# EAGLE design stacja_meteo_v3 (EAGLE 7.7.0)
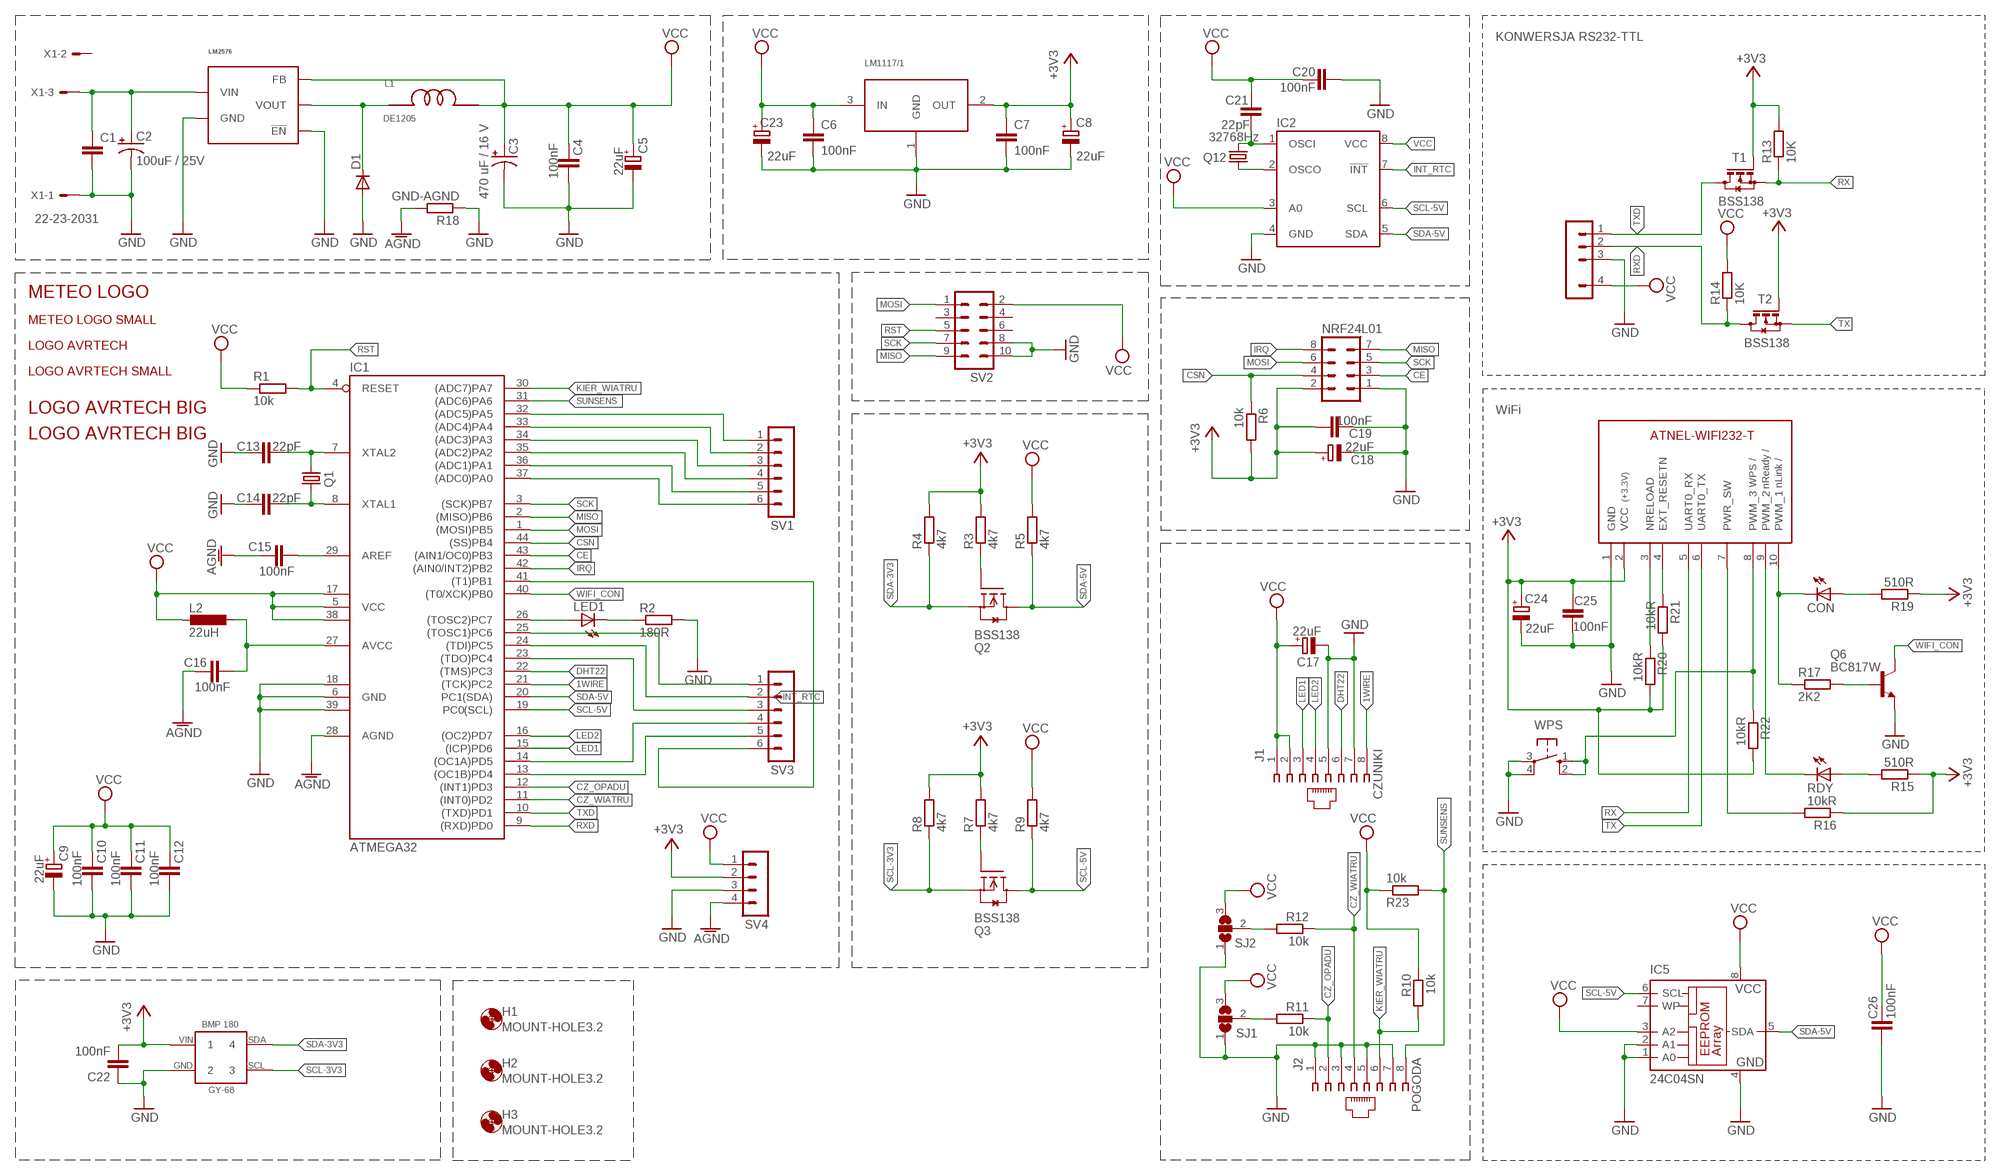
[diagram p0: schematic, sheet 1]

## Parts
BMP1  GY-68  [GY-68]
C1  C-EUC1206  [C1206]
C2  100uF / 25V  CAP_POLD  [PANASONIC_D]
C3  470 uF / 16 V  CAP_POLE  [PANASONIC_E]
C4  100nF  C-EUC1206  [C1206]
C5  22uF  CPOL-EUSMCA  [SMC_A]
C6  100nF  C-EUC0805  [C0805]
C7  100nF  C-EUC0805  [C0805]
C8  22uF  CPOL-EUSMCA  [SMC_A]
C9  22uF  CPOL-EUSMCA  [SMC_A]
C10  100nF  C-EUC1206  [C1206]
C11  100nF  C-EUC1206  [C1206]
C12  100nF  C-EUC1206  [C1206]
C13  22pF  C-EUC0805K  [C0805K]
C14  22pF  C-EUC0805K  [C0805K]
C15  100nF  C-EUC1206  [C1206]
C16  100nF  C-EUC1206  [C1206]
C17  22uF  CPOL-EUSMCA  [SMC_A]
C18  22uF  CPOL-EUSMCA  [SMC_A]
C19  100nF  C-EUC0805  [C0805]
C20  100nF  C-EUC1206K  [C1206K]
C21  22pF  C-EUC1206K  [C1206K]
C22  100nF  C-EUC1206  [C1206]
C23  22uF  CPOL-EUSMCA  [SMC_A]
C24  22uF  CPOL-EUSMCA  [SMC_A]
C25  100nF  C-EUC0805  [C0805]
C26  100nF  C-EUC1206K  [C1206K]
CON  LEDSML0805  [SML0805]
D1  DIODE-SMC  [SMC]
H1  MOUNT-HOLE3.2  [3,2]
H2  MOUNT-HOLE3.2  [3,2]
H3  MOUNT-HOLE3.2  [3,2]
IC1  ATMEGA32  MEGA32ORIGINAL  [TQFP44]
IC2  RTC_PCF8583T  [SO08]
IC5  24C04SN  [SO-08]
J1  CZUNIKI  556416-1  [556416-1]
J2  POGODA  556416-1  [556416-1]
L1  DE1205  [DE1205]
L2  22uH  L-EUIR-2  [IR-2]
LED1  LED5MM  [LED5MM]
LM1117/1  LM1117-3.3  [SOT223]
LM2576  LM2576D2PAK-5  [D2PAK-5]
NRF24L01  ML10  [ML10]
Q1  11.059 MHz  CSM-7X-DU  [CSM-7X-DU]
Q2  BSS138  [SOT23]
Q3  BSS138  [SOT23]
Q6  BC817W  BC817-16LT1SMD  [SOT23-BEC]
Q12  32768Hz  MC-406  [MC-406]
R1  10k  R-EU_R0603  [R0603]
R2  180R  R-EU_R0805  [R0805]
R3  4k7  R-EU_R0805  [R0805]
R4  4k7  R-EU_R0805  [R0805]
R5  4k7  R-EU_R0805  [R0805]
R6  10k  R-EU_R0805W  [R0805W]
R7  4k7  R-EU_R0805  [R0805]
R8  4k7  R-EU_R0805  [R0805]
R9  4k7  R-EU_R0805  [R0805]
R10  10k  R-EU_R0603  [R0603]
R11  10k  R-EU_R0603  [R0603]
R12  10k  R-EU_R0603  [R0603]
R13  10K  R-EU_R0805  [R0805]
R14  10K  R-EU_R0805  [R0805]
R15  510R  R-EU_R0603  [R0603]
R16  10kR  R-EU_R0603  [R0603]
R17  2K2  R-EU_R0603  [R0603]
R18  GND-AGND  R-EU_R0805  [R0805]
R19  510R  R-EU_R0603  [R0603]
R20  10kR  R-EU_R0603  [R0603]
R21  10kR  R-EU_R0603  [R0603]
R22  10kR  R-EU_R0603  [R0603]
R23  10k  R-EU_R0603  [R0603]
RDY  LEDSML0805  [SML0805]
RS232-TTL  ATB-BTM-222  [ATB-BTM-222]
SJ1  SJ2W  [SJ_2]
SJ2  SJ2W  [SJ_2]
SV1  MA06-1  [MA06-1]
SV2  ML10  [ML10]
SV3  MA06-1  [MA06-1]
SV4  MA04-1  [MA04-1]
T1  BSS138  BSS123  [SOT23]
T2  BSS138  BSS123  [SOT23]
U$2  ATNEL-WIFI232-T_2  [ATNEL-WIFI232-T_2]
U$3  METEO_LOGO  [LOGO_METEO]
U$4  METEO_LOGO_SMALL  [LOGO_METEO_SMALL]
U$6  LOGO_AVRTECH  [LOGO_AVRTECH]
U$7  LOGO_AVRTECH_SMALL  [LOGO_AVRTECH_SMALL]
U$8  LOGO_AVRTECH_BIG  [LOGOAVRTECHBIG]
U$9  LOGO_AVRTECH_BIG  [LOGOAVRTECHBIG]
WPS  10-XX  [B3F-10XX]
X1  22-23-2031  [22-23-2031]

## Nets
1WIRE: IC1.21((TCK)PC2) J1.8
+3V3: BMP1.1 C7.1 C8.+ C18.+ C19.1 C22.2 C24.+ C25.1 LM1117/1.2(OUT) NRF24L01.2 R3.2 R4.2 R6.2 R7.2 R8.2 R13.2 R15.1 R16.1 R19.1 R20.2 R21.2 R22.2 SV4.2 T1.1(G) T2.1(G) U$2.2(VCC)
AGND: C15.1 C16.1 IC1.28(AGND) R18.2 SV4.4
CE: IC1.43((AIN1/OC0)PB3) NRF24L01.3
CSN: IC1.44((SS)PB4) NRF24L01.4 R6.1
CZ_OPADU: IC1.12((INT1)PD3) J2.2 R11.1
CZ_WIATRU: IC1.11((INT0)PD2) J2.4 R12.1
DHT22: IC1.22((TMS)PC3) J1.6
GND: BMP1.2 C1.2 C2.- C3.- C4.2 C5.- C6.2 C7.2 C8.- C9.- C10.2 C11.2 C12.2 C13.1 C14.1 C17.- C18.- C19.2 C20.2 C22.1 C23.- C24.- C25.2 C26.2 D1.A IC1.6(GND) IC1.18(GND1) IC1.39(GND2) IC2.4(GND) IC5.1(A0) IC5.2(A1) IC5.4(GND) J1.5 J1.7 J2.1 J2.3 J2.5 J2.7 LM1117/1.1(GND) LM2576.P$3(GND) LM2576.P$5(!EN) LM2576.P$6(GND) NRF24L01.1 Q6.E R2.2 R18.1 RS232-TTL.3(GND) SJ1.1 SJ2.1 SV2.8 SV2.10 SV4.3 U$2.1(GND) WPS.3(P) WPS.4(P1) X1.1
INT_RTC: IC1.24((TDI)PC5) IC2.7(!INT) SV3.2
IRQ: IC1.42((AIN0/INT2)PB2) NRF24L01.8
KIER_WIATRU: IC1.30((ADC7)PA7) J2.6 R10.2
LED1: IC1.15((ICP)PD6) J1.3
LED2: IC1.16((OC2)PD7) J1.4
MISO: IC1.2((MISO)PB6) NRF24L01.7 SV2.9
MOSI: IC1.1((MOSI)PB5) NRF24L01.6 SV2.1
N$1: C15.2 IC1.29(AREF)
N$2: IC1.26((TOSC2)PC7) LED1.A
N$3: C16.2 IC1.27(AVCC) L2.1
N$4: LED1.K(C) R2.1
N$6: Q2.1(G) R3.1
N$7: C13.2 IC1.7(XTAL2) Q1.2
N$8: C14.2 IC1.8(XTAL1) Q1.1
N$9: R15.2 RDY.A
N$10: R12.2 SJ2.2
N$11: R11.2 SJ1.2
N$12: RDY.C U$2.9(PWM_2)
N$13: Q3.1(G) R7.1
N$14: R16.2 U$2.7(PWR_SW)
N$15: R20.1 U$2.3(NRELOAD)
N$16: R21.1 U$2.4(EXT_RESETN)
N$17: IC1.32((ADC5)PA5) SV1.1
N$18: Q6.B R17.2
N$19: IC1.33((ADC4)PA4) SV1.2
N$20: R22.1 U$2.8(PWM_3) WPS.1(S) WPS.2(S1)
N$21: IC1.34((ADC3)PA3) SV1.3
N$22: IC1.35((ADC2)PA2) SV1.4
N$23: IC1.36((ADC1)PA1) SV1.5
N$24: CON.A R19.2
N$25: IC1.37((ADC0)PA0) SV1.6
N$26: IC1.41((T1)PB1) SV3.6
N$27: IC1.25((TOSC1)PC6) SV3.1
N$29: IC1.23((TDO)PC4) SV3.3
N$30: IC1.14((OC1A)PD5) SV3.4
N$31: IC1.13((OC1B)PD4) SV3.5
N$36: D1.C L1.P$1 LM2576.P$2(VOUT)
N$37: C1.1 C2.+ LM2576.P$1(VIN) X1.3
N$54: IC2.2(OSCO) Q12.2
OSCI1: C21.2 IC2.1(OSCI) Q12.1
PWM_1: CON.C R17.1 U$2.10(PWM_1)
RST: IC1.4(RESET) R1.2 SV2.5
RX: R13.1 T1.2(S) U$2.5(UART0_RX)
RXD: IC1.9((RXD)PD0) R14.1 RS232-TTL.2(TX) T2.3(D)
SCK: IC1.3((SCK)PB7) NRF24L01.5 SV2.7
SCL-3V3: BMP1.3 Q3.2(S) R8.1
SCL-5V: IC1.19(PC0(SCL)) IC2.6(SCL) IC5.6(SCL) Q3.3(D) R9.1
SDA-3V3: BMP1.4 Q2.2(S) R4.1
SDA-5V: IC1.20(PC1(SDA)) IC2.5(SDA) IC5.5(SDA) Q2.3(D) R5.1
SUNSENS: IC1.31((ADC6)PA6) J2.8 R23.2
TX: T2.2(S) U$2.6(UART0_TX)
TXD: IC1.10((TXD)PD1) RS232-TTL.1(RX) T1.3(D)
VCC: C3.+ C4.1 C5.+ C6.1 C9.+ C10.1 C11.1 C12.1 C17.+ C20.1 C21.1 C23.+ C26.1 IC1.5(VCC) IC1.17(VCC1) IC1.38(VCC2) IC2.3(A0) IC2.8(VCC) IC5.3(A2) IC5.8(VCC) J1.1 J1.2 L1.P$3 L2.2 LM1117/1.3(IN) LM2576.P$4(FB) R1.1 R5.2 R9.2 R10.1 R14.2 R23.1 RS232-TTL.4(VCC) SJ1.3 SJ2.3 SV2.2 SV4.1
WIFI_CON: IC1.40((T0/XCK)PB0) Q6.C
Unconnected: IC5.7(WP) SV2.3 SV2.4 SV2.6 X1.2

## Notes on the sheet
- KONWERSJA RS232-TTL
- WiFi

## Library data of the parts
BMP1 = 0_majes_0:GY-68
C1 C4 C6 C7 C10-C16 C19-C22 C25 C26 = rcl:C-EU: CAPACITOR, European symbol
C2 C3 = SparkFun-Capacitors:CAP_POL: Capacitor Polarized These are standard SMD and PTH capacitors. Normally 10uF, 47uF, and 100uF in electrolytic and tantalum varieties. Always verify the external diameter of the through hole cap, it varies with capacity, voltage, and manufacturer. The EIA devices should be standard.
C5 C8 C9 C17 C18 C23 C24 = rcl:CPOL-EU: POLARIZED CAPACITOR, European symbol
CON RDY = led:LED: LED
D1 = diode:DIODE-: DIODE
H1-H3 = holes:MOUNT-HOLE: MOUNTING HOLE with drill center marker
IC1 = 0_majes_0:MEGA32: MICROCONTROLLER 32 Kbytes FLASH 2 Kbytes SRAM 1 Kbytes EEPROM USART 8-channel 10 bit ADC Size Small 59 x 17 mills pad size Medium 59 x 18 mills pad size Medium 59 x 19 mills pad size
IC2 = 0_majes_0:RTC_PCF8583T
IC5 = microchip:24C*: Serial EEPROM 1 K/2 K/4 K; MPN: M24C04-WMN6P; OC_FARNELL: 9882812; OC_NEWARK: 83K1376
J1 J2 = con-amp:556416-1: AMP connector
L1 = EAGLE_LBR_RAF_TECH:DE1205
L2 = rcl:L-EU: INDUCTOR, European symbol
LED1 = adafruit:LED: LED
LM1117/1 = 0_majes_0:LM1117-3.3
LM2576 = EAGLE_LBR_RAF_TECH:LM2576
NRF24L01 = 0_majes_0:ML10: HARTING; OC_FARNELL: unknown; OC_NEWARK: unknown
Q1 = crystal:CSM-7X-DU: SMD CRYSTAL Source: www.ecsxtal.com .. Crystal 3.6864MHz CSM_7X_DU.PDF; OC_FARNELL: unknown; OC_NEWARK: unknown
Q2 Q3 = m-pad-2.1:BSS138: Fairchild Semiconductors BSS138 N-Channel Logic Level Enhancement Mode Field Effect Transistor General Description: These N-Channel enhancement mode field effect transistors are produced using Fairchild's proprietary, high cell density, DMOS technology. These products have been designed to minimize on-state resistance while provide rugged, reliable, and fast switching performance.These products are particularly suited for low voltage, low current applications such as small servo motor control, power MOSFET gate drivers, and other switching applications. Features: 0.22 A, 50 V. RDS(ON) = 3.5Ohm @ VGS = 10 V RDS(ON) = 6.0Ohm @ VGS = 4.5 V High density cell design for extremely low RDS(ON) Rugged and Reliable Compact industry standard SOT-23 surface mount package Please send any comments to: messi@users.sourceforge.net
Q6 = transistor-npn:BC817*: NPN Transistor
Q12 = 0_majes_0:MC-406: kHz RANGE CRYSTAL UNIT SMD Source: MC-306_405_406_E07X.PDF Homepage <http://www.epsontoyocom.co.jp>; MF: BANNER ENGINEERING CORPORATION; MPN: MQDMC-406; OC_FARNELL: 1216226; OC_NEWARK: 21H2317
R1-R12 R15-R23 = rcl:R-EU_: RESISTOR, European symbol
R13 R14 = resistor:R-EU_: RESISTOR, European symbol
RS232-TTL = 0_majes_0:ATB-BTM-222
SJ1 SJ2 = jumper:SJ2W: SMD solder JUMPER
SV1 SV3 = 0_majes_0:MA06-1: PIN HEADER; OC_FARNELL: unknown; OC_NEWARK: unknown
SV2 = con-harting-ml:ML10: HARTING; OC_FARNELL: unknown; OC_NEWARK: unknown
SV4 = 0_majes_0:MA04-1: PIN HEADER; OC_FARNELL: unknown; OC_NEWARK: unknown
T1 T2 = transistor-small-signal:BSS123: N-CHANNEL MOS FET
U$2 = ATNEL-WIFI232-T:ATNEL-WIFI232-T_2
U$3 = 0_majes_0:METEO_LOGO
U$4 = 0_majes_0:METEO_LOGO_SMALL
U$6 = 0_majes_0:LOGO_AVRTECH
U$7 = 0_majes_0:LOGO_AVRTECH_SMALL
U$8 U$9 = 0_majes_0:LOGO_AVRTECH_BIG
WPS = switch-omron:10-XX: OMRON SWITCH; MPN: B3F-1000; OC_FARNELL: 176432; OC_NEWARK: 36M3542
X1 = con-molex:22-23-2031: .100" (2.54mm) Center Header - 3 Pin; MF: MOLEX; MPN: 22-23-2031; OC_FARNELL: 1462950; OC_NEWARK: 30C0862

## Board
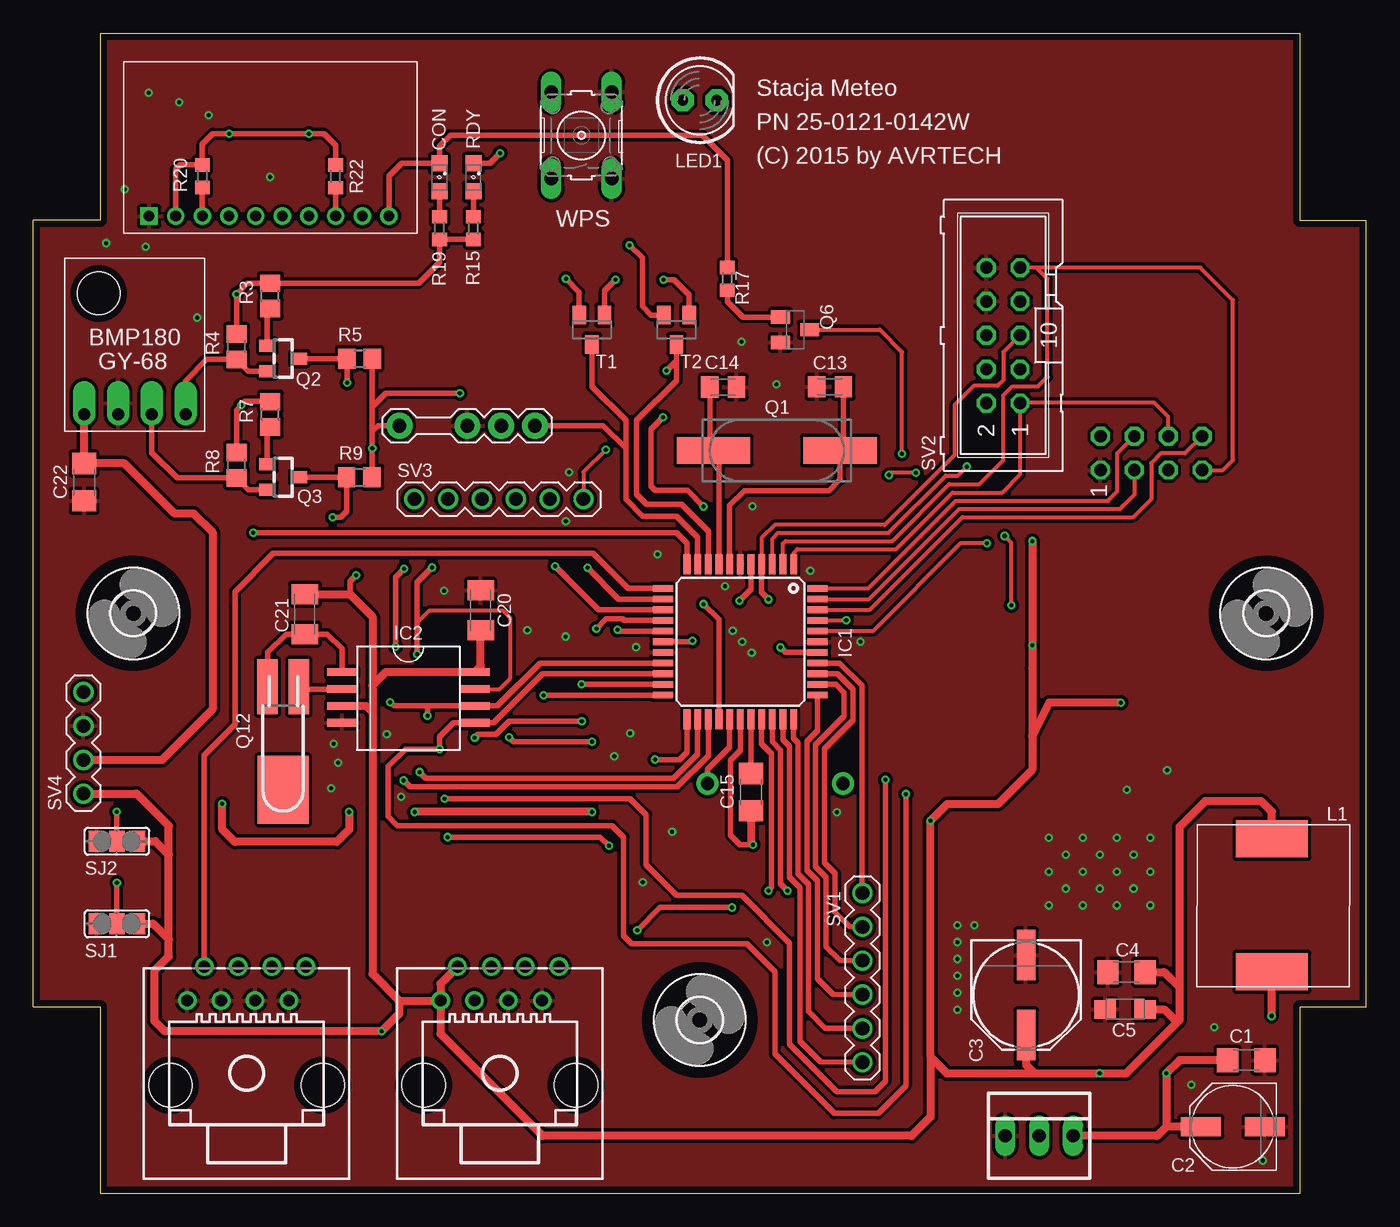
[diagram p1: board, top side]
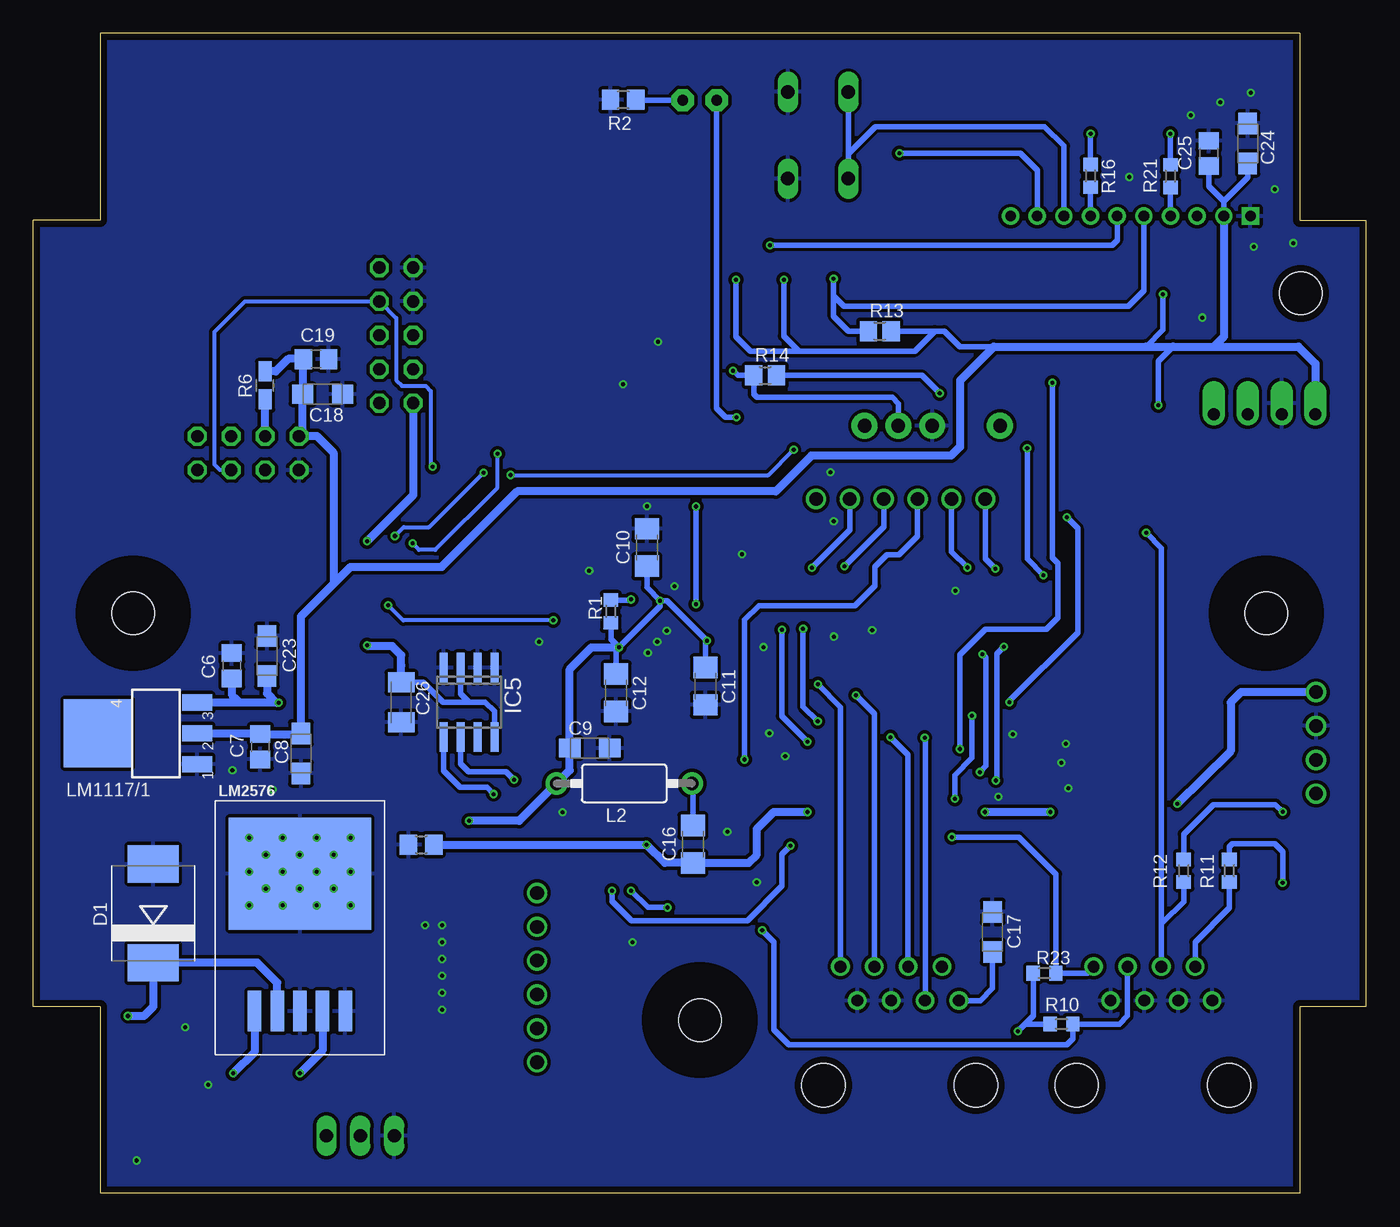
[diagram p2: board, bottom side, seen from below]

Size 100 x 87 mm. Coordinates in mm from the lower left corner, seen from the top.
Outline: 5,87 95,87 95,73 100,73 100,14 95,14 95,0 5,0 5,14 0,14 0,73 5,73 5,87
Copper layers (1*16): Top 0.035mm / dielectric 1.5mm / Bottom 0.035mm
Design rules "EagleRules": minimum track width 7mil, minimum drill 12mil, track to track 7mil, track to pad 7mil, pad to pad 7mil, via to via 7mil, smd to smd 0mil, copper to edge 20mil, drill to drill 10mil, minimum pad ring 10mil, minimum via ring 6mil, stop-mask expansion 2mil, vias tented up to drill 25mil, thermal gap 10mil

### Footprints (pad centres in the part's own frame; a part is rotated, then mirrored left to right if it is on the bottom)
GY-68 = drill 0.9 pad 1.676 offset: 1 -3.81,-3.81; 2 -1.27,-3.81; 3 1.27,-3.81; 4 3.81,-3.81 | hole 3.2: -2.71,5.26
C1206 = smd 1.6 x 1.8: 1 -1.4,0; 2 1.4,0
PANASONIC_D = smd 3 x 1.4: + 2.4,0; - -2.4,0
PANASONIC_E = smd 3.8 x 1.4: + 3,0; - -3,0
SMC_A = smd 1.6 x 1.4: + -1.5,0; - 1.5,0
C0805 = smd 1.3 x 1.5: 1 -0.95,0; 2 0.95,0
C0805K = smd 1.3 x 1.6: 1 -1,0; 2 1,0
C1206K = smd 1.5 x 2: 1 -1.5,0; 2 1.5,0
SML0805 = smd 1.2 x 1.2: A 1.05,0; C -1.05,0
SMC = smd 2.8 x 3.8: A 3.7,0; C -3.7,0
3,2 = hole 3.2: 0,0
TQFP44 = smd 1.5 x 0.5: 1 -5.8,4; 2 -5.8,3.2; 3 -5.8,2.4; 4 -5.8,1.6; 5 -5.8,0.8; 6 -5.8,0; 7 -5.8,-0.8; 8 -5.8,-1.6; 9 -5.8,-2.4; 10 -5.8,-3.2; 11 -5.8,-4; 23 5.8,-4; 24 5.8,-3.2; 25 5.8,-2.4; 26 5.8,-1.6; 27 5.8,-0.8; 28 5.8,0; 29 5.8,0.8; 30 5.8,1.6; 31 5.8,2.4; 32 5.8,3.2; 33 5.8,4 | smd 0.5 x 1.5: 12 -4,-5.8; 13 -3.2,-5.8; 14 -2.4,-5.8; 15 -1.6,-5.8; 16 -0.8,-5.8; 17 0,-5.8; 18 0.8,-5.8; 19 1.6,-5.8; 20 2.4,-5.8; 21 3.2,-5.8; 22 4,-5.8; 34 4,5.8; 35 3.2,5.8; 36 2.4,5.8; 37 1.6,5.8; 38 0.8,5.8; 39 0,5.8; 40 -0.8,5.8; 41 -1.6,5.8; 42 -2.4,5.8; 43 -3.2,5.8; 44 -4,5.8
SO08 = smd 2.235 x 0.584: 1 -4.978,1.905; 2 -4.978,0.635; 3 -4.978,-0.635; 4 -4.978,-1.905; 5 4.978,-1.905; 6 4.978,-0.635; 7 4.978,0.635; 8 4.978,1.905
SO-08 = smd 0.6 x 2.2: 1 -1.905,-2.6; 2 -0.635,-2.6; 3 0.635,-2.6; 4 1.905,-2.6; 5 1.905,2.6; 6 0.635,2.6; 7 -0.635,2.6; 8 -1.905,2.6
556416-1 = drill 0.889: 1 -4.445,5.461; 2 -3.175,8.001; 3 -1.905,5.461; 4 -0.635,8.001; 5 0.635,5.461; 6 1.905,8.001; 7 3.175,5.461; 8 4.445,8.001 | hole 3.251: -5.715,-0.889; 5.715,-0.889
DE1205 = smd 5.4 x 2.8: P$1 0.1,3.91; P$3 0.1,-6.07
IR-2 = drill 1 pad 1.676: 1 -5.08,0; 2 5.08,0
LED5MM = drill 0.813 pad 1.676 octagon: A -1.27,0; K 1.27,0
SOT223 = smd 1.219 x 2.235: 1 -2.311,-3.099; 2 0,-3.099; 3 2.311,-3.099 | smd 5.08 x 5.08: 4 0,4.369
D2PAK-5 = smd 3.05 x 1.016: P$1 4.335,-3.404; P$2 4.335,-1.702; P$3 4.335,0; P$4 4.335,1.702; P$5 4.335,3.404 | smd 8.38 x 10.66: P$6 -5.97,0
ML10 = drill 0.914 octagon: 1 -3.81,-1.27; 2 -3.81,1.27; 3 -1.27,-1.27; 4 -1.27,1.27; 5 1.27,-1.27; 6 1.27,1.27; 7 3.81,-1.27; 8 3.81,1.27
CSM-7X-DU = smd 5.5 x 2: 1 -4.75,0; 2 4.75,0
SOT23 = smd 0.9 x 1.2: 1 -0.95,-1.2; 2 0.95,-1.2; 3 0,1.2
SOT23-BEC = smd 1 x 1.4: B -0.95,-1.1; C 0,1.1; E 0.95,-1.1
MC-406 = smd 4.1 x 1.52: 1 -4,-1.175; 2 -4,1.175 | smd 5.08 x 3.81: 3 3.74,0
R0603 = smd 1 x 1.1: 1 -0.85,0; 2 0.85,0
R0805 = smd 1.3 x 1.5: 1 -0.95,0; 2 0.95,0
R0805W = smd 1.5 x 1: 1 -1.052,0; 2 1.052,0
R0805' = smd 1.3 x 1.5: 1 -0.85,0; 2 0.85,0
ATB-BTM-222 = drill 1.016 pad 1.93: 1 -0.013,5.076; 2 -0.013,2.536; 3 -0.013,-0.004; 4 -0.013,-5.084
SJ_2 = smd 1.168 x 1.6: 1 -1.524,0; 2 0,0; 3 1.524,0
MA06-1 = drill 1.016: 1 -6.35,0; 2 -3.81,0; 3 -1.27,0; 4 1.27,0; 5 3.81,0; 6 6.35,0
ML10' = drill 0.914 octagon: 1 -5.08,-1.27; 2 -5.08,1.27; 3 -2.54,-1.27; 4 -2.54,1.27; 5 0,-1.27; 6 0,1.27; 7 2.54,-1.27; 8 2.54,1.27; 9 5.08,-1.27; 10 5.08,1.27
MA04-1 = drill 1.016: 1 -3.81,0; 2 -1.27,0; 3 1.27,0; 4 3.81,0
SOT23' = smd 1 x 1.4: 1 -0.95,-1.1; 2 0.95,-1.1; 3 0,1.1
ATNEL-WIFI232-T_2 = drill 0.8 pad 1.27 square: 1 -9.1,-5.45 | drill 0.8 pad 1.27: 2 -7.1,-5.45; 3 -5.1,-5.45; 4 -3.1,-5.45; 5 -1.1,-5.45; 6 0.9,-5.45; 7 2.9,-5.45; 8 4.9,-5.45; 9 6.9,-5.45; 10 8.9,-5.45
B3F-10XX = drill 1.016 long: 1 -3.251,2.261; 2 3.251,2.261; 3 -3.251,-2.261; 4 3.251,-2.261
22-23-2031 = drill 1 long: 1 -2.54,0; 2 0,0; 3 2.54,0

### Placement (x,y rotation side)
BMP1  7.62,62.23 0 top
C1  91,10 0 top
C2  90,5 180 top
C3  74.48,14.87 270 top
C4  82.01,16.6 180 top
C5  81.91,13.8 180 top
C6  85.11,39.57 90 bottom
C7  82.97,33.5 270 bottom
C8  79.92,33 270 bottom
C9  58.26,33.39 0 bottom
C10  53.97,48.44 90 bottom
C11  49.57,38.04 270 bottom
C12  56.27,37.54 270 bottom
C13  59.78,60.5 0 top
C14  51.75,60.47 180 top
C15  53.85,30.1 90 top
C16  50.51,26.18 90 bottom
C17  28.03,19.61 90 bottom
C18  78.3,59.93 0 bottom
C19  78.8,62.57 0 bottom
C20  33.56,43.73 90 top
C21  20.37,43.45 270 top
C22  3.81,53.34 90 top
C23  82.47,40.31 90 bottom
C24  8.89,78.74 90 bottom
C25  11.81,77.99 90 bottom
C26  72.39,36.83 270 bottom
CON  30.48,76.2 270 top
D1  91,21 90 bottom
H1  50,13 0 top
H2  7.5,43.5 0 top
H3  92.5,43.5 0 top
IC1  53.04,41.37 270 top
IC2  28.14,37.19 0 top
IC5  67.31,36.83 180 bottom
J1  35,9 0 top
J2  16,9 0 top
L1  93.02,20.53 180 top
L2  55.66,30.74 180 bottom
LED1  50,81.98 0 top
LM1117/1  90.8,34.5 90 bottom
LM2576  80,18 270 bottom
NRF24L01  83.88,55.52 0 top
Q1  55.78,55.71 0 top
Q2  18.75,62.61 270 top
Q3  18.75,53.72 270 top
Q6  57.15,64.77 270 top
Q12  18.74,34 270 top
R1  56.67,43.64 90 bottom
R2  55.74,82.01 180 bottom
R3  17.78,67.31 90 top
R4  15.24,63.5 90 top
R5  24.49,62.61 0 top
R6  82.61,60.6 90 bottom
R7  17.78,58.42 90 top
R8  15.24,54.61 90 top
R9  24.46,53.72 0 top
R10  22.86,12.7 0 bottom
R11  10.27,24.2 90 bottom
R12  13.69,24.2 90 bottom
R13  10K  [R0805']  36.5,64.67 0 bottom
R14  10K  [R0805']  45.1,61.34 0 bottom
R15  33.02,72.39 90 top
R16  20.68,76.3 270 bottom
R17  52.07,68.58 270 top
R18  70.9,26.16 0 bottom
R19  30.48,72.39 90 top
R20  12.68,76.28 90 top
R21  14.69,76.3 90 bottom
R22  22.68,76.27 90 top
R23  24.13,16.51 0 bottom
RDY  33.02,76.2 270 top
RS232-TTL  32.56,57.56 270 top
SJ1  6.27,20.22 0 top
SJ2  6.27,26.41 0 top
SV1  62.2,16.18 90 top
SV2  [ML10']  72.77,64.35 90 top
SV3  34.92,52.07 0 top
SV4  3.76,33.78 90 top
T1  BSS138  [SOT23']  41.91,64.77 180 top
T2  BSS138  [SOT23']  48.26,64.77 180 top
U$2  17.78,78.74 0 top
U$3  87.63,71.12 0 bottom
U$4  55.24,70.48 0 top
U$6  33.3,28.96 0 top
U$7  59.69,67.31 0 top
U$8  66.04,29.21 0 top
U$9  20.32,29.21 0 bottom
WPS  41.12,79.35 90 top
X1  75.46,4.32 0 top

### Tracks (layer width: path | path; a pad name or v marks a point on that pad's centre or on a via)
1WIRE  (via drill 0.3)
  Top 0.406: IC1.21 v41.14,38.17
  Bottom 0.406: J1.8 39.45,36.47 v41.14,38.17
+3V3  (via drill 0.3)
  Top 0.406: R8.2 15.24,58.74 v15.6,59.1 15.9,59.4 17.75,59.4 R7.2 | R4.2 v15.24,67.44 16.06,68.26 R3.2 28.89,68.26 30.48,69.85 R19.1 R15.1 | T1.1 42.86,67.7 v43.69,68.53 | T2.1 49.21,67.4 48.08,68.53 v47.3,68.53 | R22.2 22.68,78.61 21.82,79.48 v20.68,79.48 v14.71,79.48 13.46,79.48 12.68,78.69 R20.2 12.66,77.14 11.02,77.14 10.68,76.8 U$2.2
  Top 0.61: BMP1.1 C22.2 6.83,54.74 10.59,50.98 12.04,50.98 13.49,49.53 13.49,36.35 9.65,32.51 SV4.2
  Bottom 0.406: 79.75,59.98 C18.+ 80.07,59.93 | v15.6,59.1 15.6,62.4 14.5,63.5 | v15.24,67.44 15.24,64.76 16.5,63.5 | R13.2 32.36,64.67 | 32.36,64.67 31.65,64.67 30.48,63.5 27.94,63.5 | v47.3,68.53 47.3,64.26 46.2,63.17 42.57,63.17 | 42.57,63.17 33.86,63.17 32.36,64.67 | v43.69,68.53 43.69,64.29 42.57,63.17 | U$2.2 10.68,74.42 | 10.68,74.42 8.89,76.21 C24.+ | 10.68,74.42 11.81,75.55 | 11.81,75.55 C25.1 11.92,77.15 | 11.82,75.54 11.81,75.55 | v20.68,79.48 R16.1 | v14.71,79.48 14.71,77.17 R21.2
  Bottom 0.61: LM1117/1.2 83.02,34.5 C7.1 | 83.45,34.5 C7.1 | C7.1 83.35,34.5 | C18.+ 79.8,57.06 NRF24L01.2 78.71,56.79 77.47,55.55 77.47,45.72 | 79.75,59.98 C19.1 79.77,62.59 80.87,62.59 81.81,61.65 R6.2 | BMP1.1 3.81,62.23 5.08,63.5 11.43,63.5 | 11.43,63.5 14.5,63.5 16.5,63.5 27.94,63.5 30.48,60.96 30.48,55.98 31.14,55.32 41.63,55.32 44.3,52.65 63.7,52.65 69.37,46.99 76.2,46.99 77.47,45.72 | C7.1 79.97,34.45 C8.+ 79.92,43.27 77.47,45.72 | U$2.2 10.68,64.25 11.43,63.5
AGND  (via drill 0.3)
  Top 0.406: IC1.28 53.04,33.23 52.31,32.5 52.31,26.86 53.03,26.14 v53.98,26.14
  Top 0.61: C15.1 53.85,26.27 v53.98,26.14 | v41.91,28.6 v28.6,28.6 | v23.7,28.6 23.7,27.3 22.76,26.36 15.11,26.36 14.17,27.3 v14.17,29.21
  Bottom 0.61: R18.2 54,26.16 v53.98,26.14 52.62,24.78 C16.1 46.34,24.78 45.72,25.4 45.72,27.33 44.45,28.6 v41.91,28.6 | v28.6,28.6 v23.7,28.6 | v14.17,29.21 10.24,33.1 | 10.24,33.1 10.16,33.17 | SV4.4 9.4,37.59 10.16,36.83 10.16,33.17 10.24,33.1
CE
  Top 0.305: NRF24L01.3 82.61,52.41 81.78,51.58 81.66,51.46 81.53,51.33 69.47,51.33 62.71,44.57 IC1.43
CSN
  Top 0.305: NRF24L01.4 81.31,55.48 81.31,52.63 80.62,51.94 69.22,51.94 62.64,45.37 IC1.44
  Bottom 0.61: NRF24L01.4 R6.1
CZ_OPADU
  Top 0.406: IC1.12 44.63,45.37 41.99,48.01 18.01,48.01 15.14,45.14 15.14,35.18 12.82,32.87 J2.2
  Bottom 0.406: R11.1 10.27,21.4 12.82,18.85 J2.2
CZ_WIATRU  (via drill 0.3)
  Top 0.406: v16.51,49.53 48.26,49.53 49.04,48.75 IC1.11
  Bottom 0.406: J2.4 15.37,20.32 | 15.37,20.32 15.37,48.38 v16.51,49.53 | R12.1 13.69,21.87 15.24,20.32 15.37,20.32
DHT22  (via drill 0.3)
  Top 0.406: IC1.22 38.31,37.37 v38.28,37.34
  Bottom 0.406: J1.6 36.91,35.97 v38.28,37.34
GND  (via drill 0.3)
  other vias: 82.04,30.28 76.2,26.67 78.74,26.67 81.28,26.67 83.82,26.67 76.2,24.13 76.2,21.59 78.74,21.59 78.74,24.13 81.28,24.13 81.28,21.59 83.82,21.59 83.82,24.13 77.47,25.4 77.47,22.86 80.01,22.86 80.01,25.4 82.55,25.4 82.55,22.86 85.06,31.74 92.25,2.46 86.89,8.15 88.6,12.45 69.34,17.58 69.34,16.31 69.34,15.04 69.34,13.77 69.34,18.85 69.34,20.12 70.61,20.12 46.84,47.93 45.22,40.97 62.05,41.38 53.95,51.54 51.89,45.54 53.9,40.54 53.19,41.38 52.47,42.19 58.29,46.69 40.18,54.08 39.95,50.42 12.29,65.68 5.46,71.27 6.86,75.31 8.43,70.99 10.95,81.84 8.66,82.55 13.15,80.85 55.75,60.68 53.13,63.88 17.78,76.23 30.81,45.19 37.06,42.24 39.93,41.76 44.78,34.49 43.59,32.79 22.86,32.28 22.36,30.38 22.53,33.73 26.52,34.44 27.59,29.74 55.04,18.82 47.93,27.13 45.72,23.34 60.3,28.59
  pour Top (isolate 0.254): -2.54,88.9 101.6,88.9 101.6,-3.81 -2.54,-3.81
  pour Bottom (isolate 0.254): -2.54,88.9 101.6,88.9 101.6,-3.81 -2.54,-3.81
INT_RTC  (via drill 0.3)
  Top 0.305: IC2.7 34.98,37.83 35.76,38.61 35.76,43.18 35.26,43.69 29.69,43.69 28.8,42.8
  Top 0.406: IC1.24 49.84,32.95 48.03,31.14 29.44,31.14 v28.98,31.6 | v28.8,40.44 28.8,42.8 28.8,45.82 v29.92,46.94
  Bottom 0.406: v28.98,31.6 28.52,32.05 28.52,40.16 v28.8,40.44 | v29.92,46.94 31.11,48.13 SV3.2
IRQ
  Top 0.305: NRF24L01.8 86.4,55.5 84.61,55.5 83.87,54.76 83.87,52.07 82.53,50.72 69.72,50.72 62.77,43.77 IC1.42
KIER_WIATRU  (via drill 0.3)
  Top 0.406: IC1.30 54.64,33.73 55.4,32.97 55.4,22.96 v55.14,22.71 | v45.31,19.74 47.02,21.44 v52.43,21.44
  Bottom 0.406: J2.6 17.91,13.31 18.52,12.7 R10.2 22.01,11.59 22.45,11.15 43.31,11.15 44.42,12.27 44.42,18.85 v45.31,19.74 | v52.43,21.44 53.87,21.44 v55.14,22.71
LED1  (via drill 0.3)
  Top 0.406: IC1.15 44.3,42.97 44.2,43.08 42.98,43.08 v42.24,42.34 | v41.15,35.41 35.71,35.41 34.72,34.42 33.38,34.42 v33.12,34.16
  Bottom 0.406: v42.24,42.34 42.24,36.5 v41.15,35.41 | J1.3 33.07,14.48 33.07,34.11 v33.12,34.16
LED2  (via drill 0.3)
  Top 0.406: IC1.16 43.94,42.17 v43.84,42.27 | v41.91,33.86 36.04,33.86 v35.69,34.21
  Bottom 0.406: v43.84,42.27 43.84,35.79 v41.91,33.86 | J1.4 34.37,32.89 v35.69,34.21
MISO
  Top 0.305: 75.27,69.43 87.57,69.43 90,67 90,55 89.25,54.25 NRF24L01.7 | 75.27,69.43 SV2.9 | 75.27,69.43 76.1,68.61 76.1,61.24 75.39,60.53 73.46,60.53 72.77,59.84 72.77,54.99 70.97,53.19 68.71,53.19 64.44,48.92 56.44,48.92 56.24,48.72 IC1.2
MOSI
  Top 0.305: NRF24L01.6 85.15,58.25 84.1,59.3 74.07,59.3 SV2.1 74.04,53.9 72.69,52.55 68.96,52.55 64.72,48.31 57.33,48.31 57.04,48.02 IC1.1
N$1
  Top 0.406: IC1.29 C15.2
N$2  (via drill 0.3)
  Top 0.406: v50.29,44.2 51.44,43.05 IC1.26 | v50.29,51.51 49.07,52.73 46.63,52.73 46.33,53.03 46.33,57.3 v47.24,58.22
  Bottom 0.406: LED1.A 48.73,58.89 48.06,58.22 v47.24,58.22 | v50.29,51.51 v50.29,44.2
N$3
  Top 0.406: IC1.27 52.24,33.47 50.58,31.81 L2.1
  Bottom 0.406: L2.1 50.51,30.74 C16.2
N$4
  Bottom 0.406: R2.1 54.76,81.98 LED1.K
N$6
  Top 0.406: Q2.1 17.55,66.12 R3.1
N$7
  Top 0.406: C13.2 60.78,55.96 Q1.2 60.53,53.55 59.69,52.7 53.34,52.7 52.24,51.6 IC1.7
N$8
  Top 0.406: 49.4,55.71 Q1.1 | C14.2 50.76,55.98 Q1.1 | IC1.8 51.44,55.3 Q1.1
N$9
  Top 0.406: R15.2 RDY.A
N$10  (via drill 0.3)
  Top 0.406: SJ2.2 6.27,27.94 v6.27,28.62
  Bottom 0.406: R12.2 13.69,26.95 11.48,29.16 6.81,29.16 v6.27,28.62
N$11  (via drill 0.3)
  Top 0.406: v6.27,23.29 6.27,21.16 SJ1.2
  Bottom 0.406: R11.2 10.27,26 10.06,26.21 6.86,26.21 6.27,25.63 v6.27,23.29
N$12  (via drill 0.3)
  Top 0.406: RDY.C 34.27,77.25 v35.03,78
  Bottom 0.406: v35.03,78 25.93,78 24.68,76.75 U$2.9
N$13
  Top 0.406: Q3.1 17.55,57.23 R7.1
N$14
  Bottom 0.406: R16.2 U$2.7
N$15
  Top 0.406: U$2.3 R20.1
N$16
  Bottom 0.406: U$2.4 R21.1
N$17
  Top 0.406: IC1.32 56.24,34.01 56.72,33.53 56.72,23.7 57.51,22.91 57.51,11.4 59.05,9.86 SV1.1
N$18
  Top 0.406: Q6.B 53.23,65.72 52.07,66.88 R17.2
N$19
  Top 0.406: IC1.33 57.04,34.15 57.38,33.81 57.38,23.95 58.17,23.16 58.17,13.64 59.41,12.39 SV1.2
N$20
  Top 0.406: U$2.8 R22.1
  Bottom 0.406: U$2.8 22.68,78.56 24.13,80.01 36.83,80.01 38.86,77.98 | 38.86,77.98 WPS.1 | WPS.2 38.86,77.98
N$21
  Top 0.406: IC1.34 58.84,34.71 58.04,33.91 58.04,24.23 58.83,23.44 58.83,16.1 59.99,14.94 SV1.3
N$22
  Top 0.406: IC1.35 60.2,38.17 60.83,37.54 60.83,35.76 58.7,33.63 58.7,24.51 59.49,23.72 59.49,18.49 60.5,17.48 SV1.4
N$23
  Top 0.406: IC1.36 60.34,38.97 61.49,37.82 61.49,35.48 59.36,33.35 59.36,24.79 60.15,24 60.15,21.08 61.21,20.02 SV1.5
N$24
  Top 0.406: R19.2 CON.A
N$25
  Top 0.406: IC1.37 60.48,39.77 62.15,38.1 62.15,22.58 SV1.6
N$26  (via drill 0.3)
  Top 0.305: IC1.41 60.98,42.97 v60.98,42.98 | v73.38,44.12 73.38,48.79 v72.87,49.3 | v66.22,54.05 64.36,54.05 v64.19,53.87 | v42.95,55.78 41.27,54.1 SV3.6
  Bottom 0.305: v60.98,42.98 72.24,42.98 v73.38,44.12 | v72.87,49.3 72.21,49.96 70.31,49.96 v66.22,54.05 | v64.19,53.87 44.86,53.87 v42.95,55.78
N$27  (via drill 0.3)
  Top 0.406: IC1.25 50.64,32.81 48.31,30.48 28.27,30.48 v27.79,30.96 | v27.18,41 27.18,46.2 v27.81,46.84
  Bottom 0.406: v27.81,46.84 28.57,47.6 SV3.1 | v27.18,41 27.71,40.46 27.71,31.04 v27.79,30.96
N$29  (via drill 0.3)
  Top 0.406: IC1.23 49.04,33.09 48.49,32.54 v46.63,32.54
  Bottom 0.406: v46.63,32.54 46.63,43 45.57,44.07 38.35,44.07 36.85,45.57 36.85,46.99 35.97,47.88 35.05,47.88 33.66,49.28 SV3.3
N$30  (via drill 0.3)
  Top 0.406: IC1.14 42.41,43.77 v39.14,47.04
  Bottom 0.406: SV3.4 36.2,49.99 v39.14,47.04
N$31  (via drill 0.3)
  Top 0.406: IC1.13 43.92,44.57 v41.58,46.91
  Bottom 0.406: SV3.5 38.73,49.76 v41.58,46.91
N$36  (via drill 0.3)
  Top 0.61: v92.9,13.3 L1.P$1
  Bottom 0.61: LM2576.P$2 81.7,15.8 83.2,17.3 D1.C 91,14 91.7,13.3 v92.9,13.3
N$37  (via drill 0.3)
  Top 0.61: C1.1 86,10 v85,9 85,5 | C2.+ 85,5 | X1.3 84.32,4.32 85,5
  Bottom 0.61: LM2576.P$1 83.4,10.6 v85,9
N$54
  Top 0.406: IC2.2 20.09,37.83 arc-90 Q12.2
OSCI1
  Top 0.406: IC2.1 23.16,40.84 22.05,41.95 C21.2 18.95,41.95 17.57,40.56 Q12.1
PWM_1
  Top 0.406: U$2.10 26.68,76.31 27.62,77.25 CON.C 30.48,78.56 31.29,79.38 50.19,79.38 52.07,77.5 R17.1
RST  (via drill 0.3)
  Top 0.305: SV2.5 74.03,64.35 72.77,63.09 72.77,60.98 72.34,60.55 70.56,60.55 69.11,59.11 69.11,55.37 63.88,50.14 55.63,50.14 54.64,49.15 IC1.4
  Top 0.406: IC1.4 54.64,45.07 v55.17,44.54
  Bottom 0.406: v55.17,44.54 55.22,44.49 R1.2
RX  (via drill 0.3)
  Top 0.406: T1.2 40.96,67.57 v39.95,68.58
  Bottom 0.406: R13.1 38.84,64.67 39.95,65.79 39.95,67.31 | 39.95,67.31 v39.95,68.58 | U$2.5 16.68,67.7 17.83,66.55 39.19,66.55 39.95,67.31
RXD  (via drill 0.3)
  Top 0.406: IC1.9 50.64,49.64 48.62,51.66 46.02,51.66 45.26,52.43 45.26,57.96 48.26,60.96 48.26,62.46 | T2.3 48.26,62.46 | v47.5,61.7 48.26,62.46
  Bottom 0.406: v47.5,61.7 47.14,61.34 R14.1 45.95,59.92 45.72,59.69 35.56,59.69 35.1,59.23 RS232-TTL.2
SCK  (via drill 0.3)
  Top 0.305: v70.05,54.51 69.37,53.82 68.45,53.82 64.16,49.53 55.88,49.53 55.44,49.09 IC1.3
  Bottom 0.305: NRF24L01.5 86,54.25 86.41,54.66 86.41,64.62 84.12,66.9 74.05,66.9 SV2.7 74.03,66.89 72.77,65.63 72.77,60.98 72.34,60.55 70.56,60.55 70.18,60.17 70.18,54.63 v70.05,54.51
SCL-3V3
  Top 0.406: BMP1.3 8.89,55.55 10.78,53.66 R8.1 16.13,52.77 Q3.2
SCL-5V  (via drill 0.3)
  Top 0.406: IC1.19 38.02,39.77 34.8,36.55 IC2.6 29.59,36.55 | Q3.3 R9.1 23.51,51.14 23.07,50.7 v22.45,50.7 | 29.59,36.55 27.05,36.55 v26.77,36.83 | v63.93,31.01 63.93,8.41 63.14,7.62 60.3,7.62 56.74,11.18 56.74,18.77 53.16,22.35 48.26,22.35 45.97,24.64 45.97,28.4 44.78,29.59 v30.86,29.59 | v29.57,35.81 29.57,36.52 29.59,36.55
  Bottom 0.406: v22.45,50.7 21.64,49.89 21.64,42.06 26.77,36.93 v26.77,36.83 | IC5.6 67.94,32.23 67.33,31.62 64.54,31.62 v63.93,31.01 | v30.86,29.59 30.86,31.37 29.57,32.66 v29.57,35.81
SDA-3V3
  Top 0.406: BMP1.4 11.43,60.96 13.02,62.55 R4.1 16.13,61.66 Q2.2
SDA-5V  (via drill 0.3)
  Top 0.406: IC1.20 38.21,38.97 34.52,35.28 IC2.5 31.52,35.28 30.48,34.24 v30.48,33.33 27.91,33.33 26.62,32.03 26.62,28.27 27.3,27.58 43.43,27.58 44.3,26.72 44.3,19.3 44.88,18.72 53.54,18.72 55.63,16.64 55.63,10.46 60.1,5.99 63.4,5.99 65.46,8.05 v65.46,29.95 | Q2.3 R5.1 23.54,60.79 v23.55,60.78
  Bottom 0.406: v23.55,60.78 23.55,47.68 23.11,47.24 23.11,43.16 23.98,42.29 28.57,42.29 30.48,40.39 v30.48,33.33 | IC5.5 69.22,31.7 67.97,30.45 65.96,30.45 v65.46,29.95
SUNSENS  (via drill 0.3)
  Top 0.406: v31.09,26.72 42.52,26.72 v43.18,26.06 | v56.59,22.68 56.06,23.22 56.06,33.25 55.44,33.87 IC1.31
  Bottom 0.406: J2.8 20.94,16.51 R23.2 23.28,23.94 26.06,26.72 v31.09,26.72 | v43.18,26.06 43.81,25.43 43.81,23.06 46.43,20.45 55.12,20.45 56.59,21.92 v56.59,22.68
TX  (via drill 0.3)
  Top 0.406: T2.2 46.35,65.87 45.7,66.52 45.7,70.16 v44.73,71.12
  Bottom 0.406: U$2.6 18.68,71.49 19.05,71.12 v44.73,71.12
TXD
  Top 0.406: IC1.10 49.84,49.22 48.26,50.8 45.72,50.8 44.45,52.07 44.45,55.88 | 44.45,55.88 44.45,57.96 41.91,60.5 T1.3 | RS232-TTL.1 42.76,57.57 44.45,55.88
VCC  (via drill 0.3)
  Top 0.406: 75,9 75.06,9.06 | v52.97,44.44 53.84,45.31 IC1.5 | v56.07,40.94 56.44,40.57 IC1.38 | v49.47,41.44 49.4,41.37 IC1.17 | R5.2 25.44,59 | 25.44,59 25.44,57.15 | 25.44,57.15 v25.44,55.88 25.44,53.75 R9.2 | 23.76,44.95 23.76,45.91 v24.21,46.35 | SJ1.3 | v32,60 26.44,60 25.44,59 | RS232-TTL.4 25.86,57.57 25.44,57.15
  Top 0.61: 85.83,12.83 82,9 v80,9 75.12,9 75.06,9.06 74.48,9.64 C3.+ | 85.83,12.83 86,13 86,15.44 | 86,15.44 86,27.5 87.91,29.41 92.13,29.41 92.92,28.62 L1.P$3 | C5.+ 84.85,13.8 85.83,12.83 | C4.1 84.84,16.6 86,15.44 | J1.2 30.55,15.73 J1.1 | J1.1 30.55,11.96 38.2,4.32 65.89,4.32 67.31,5.74 67.31,10.23 | 75,9 68.54,9 67.31,10.23 | C21.1 23.76,44.95 25.45,43.26 25.45,38.1 | 25.45,38.1 25.45,36.07 | 25.45,36.07 25.45,16.46 27.45,14.46 | 27.45,14.46 J1.1 | IC2.3 24.96,36.55 25.45,36.07 | 25.45,38.1 26.45,39.09 IC2.8 33.56,39.54 C20.1 | 67.31,10.23 v67.31,27.94 68.58,29.21 72.39,29.21 74.95,31.77 74.95,34.29 | v74.95,48.92 v74.95,41.1 74.95,39.37 74.95,34.29 | v81.59,36.8 76.19,36.8 74.95,34.29 | 27.45,14.46 27.45,13.48 v26.14,12.17 9.86,12.17 9.11,12.92 9.11,16.73 10.16,17.78 10.16,19.05 | 10.16,19.05 10.16,25.4 | 10.16,25.4 10.16,27.56 7.75,29.97 SV4.1 | SJ2.3 9.15,26.41 10.16,25.4 | SJ1.3 8.99,20.22 10.16,19.05
  Bottom 0.406: v56.07,40.94 52.97,44.04 v52.97,44.44 | C10.1 53.97,45.44 v52.97,44.44 | C11.1 49.57,41.34 v49.47,41.44 52.47,44.44 v52.97,44.44 | C12.1 56.27,40.74 v56.07,40.94 | R1.1 56.67,41.54 v56.07,40.94 | C17.+ 28.03,15.38 28.95,14.46 J1.1 | v24.21,46.35 25.44,47.58 v25.44,55.88 | R10.1 25.6,12.7 v26.14,12.17 24.98,13.32 R23.1 | R14.2 33.34,61.34 v32,60 | IC5.3 67.94,37.47 67.31,36.83 | C26.1 70.74,38.33 69.24,36.83 67.31,36.83 | 67.31,36.83 66.09,36.83 65.41,36.14 IC5.8
  Bottom 0.61: LM2576.P$4 78.3,10.7 v80,9 | 84.45,36.8 v81.59,36.8 81.78,36.8 82.47,37.49 C23.+ | 84.45,36.8 LM1117/1.3 | v56.07,40.94 58.12,40.94 59.76,39.3 C9.+ 59.76,31.72 L2.2 63.54,27.94 v67.31,27.94 | SV2.2 71.5,52.38 v74.95,48.92 | C6.1 85.11,37.41 84.45,36.8 | 72.39,39.6 C26.1 72.39,40.36 73.08,41.05 74.91,41.05 v74.95,41.1
WIFI_CON  (via drill 0.3)
  Top 0.305: Q6.C 63.5,64.77 65.18,63.09 v65.18,55.47 | v71.55,48.74 69.57,48.74 63,42.17 IC1.40
  Bottom 0.305: v71.55,48.74 71.07,48.26 69.85,48.26 65.18,52.93 v65.18,55.47

### Text on the board
tNames: Stacja Meteo | PN 25-0121-0142W | (C) 2015 by AVRTECH
tValues: 1-2 SPD / 3-4 RF / 5-6 DIR / 7-8 NC | 1 VCC / 2 VCC / 3 LED1 / 4 LED2 / 5 GND / 6 HUM / 7 GND / 8 TEMP | V MIN 9V / V MAX 14V
tDocu: Ver. 1.21 | www.avrtech.pl